# EAGLE design RF2ComLong (EAGLE 7.5.0)
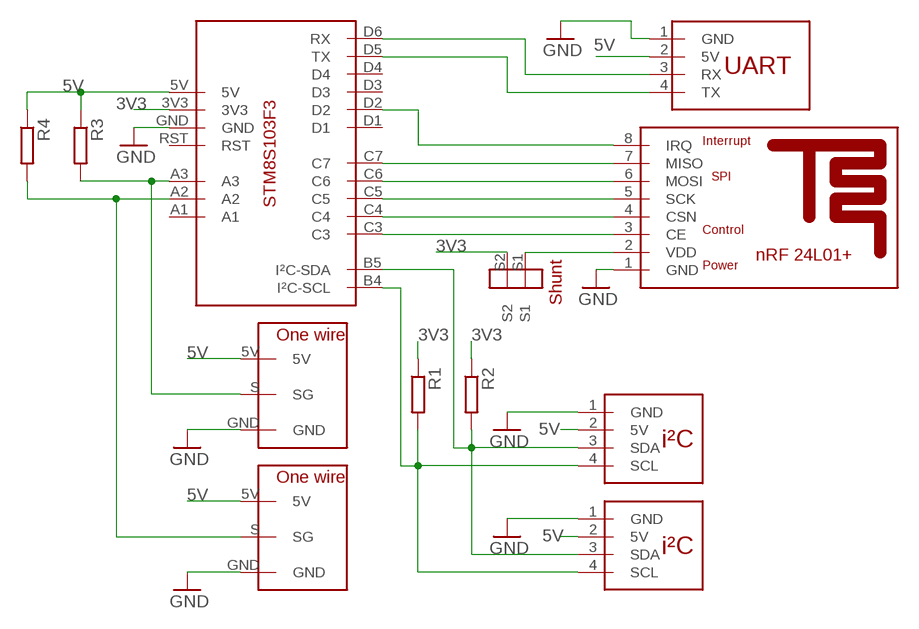
[diagram p0: schematic, sheet 1]

## Parts
R1  1k  R-EU_R1206  [R1206]
R2  1k  R-EU_R1206  [R1206]
R3  1k  R-EU_R1206  [R1206]
R4  1k  R-EU_R1206  [R1206]
U$1  STM8S103F3-DEVKITMINI  [STM8S103F3-DEVKIT-MINI]
U$2  NRF24L01+REFDESIGNMINI  [NRF24L01+REFDESIGN-MINI]
U$3  UARTMINI  [UART-MINI]
U$4  I2CMINI  [I2C-MINI]
U$5  ONE_WIRE  [ONE_WIRE]
U$6  ONE_WIRE  [ONE_WIRE]
U$7  I2CMINI  [I2C-MINI]
U$8  SMD_SHUNT  [SMD_SHUNT]

## Nets
3V3: R1.1 R2.1 U$1.3V3 U$8.S2
5V: R3.1 R4.1 U$1.5V U$3.2(5V) U$4.2(5V) U$5.5V U$6.5V U$7.2(5V)
GND: U$1.GND U$2.1(GND) U$3.1(GND) U$4.1(GND) U$5.GND U$6.GND U$7.1(GND)
N$1: U$1.D5(TX) U$3.4(TX)
N$2: U$1.C3 U$2.3(CE)
N$3: U$1.C4 U$2.4(CSN)
N$4: U$1.C5 U$2.5(SCK)
N$5: U$1.C6 U$2.6(MOSI)
N$6: U$1.C7 U$2.7(MISO)
N$7: R2.2 U$1.B5(I²C-SDA) U$4.3(SDA) U$7.3(SDA)
N$8: U$1.D2 U$2.8(IRQ)
N$9: U$1.D6(RX) U$3.3(RX)
N$10: R3.2 U$1.A3 U$6.S(SG)
N$12: R4.2 U$1.A2 U$5.S(SG)
N$13: R1.2 U$1.B4(I²C-SCL) U$4.4(SCL) U$7.4(SCL)
N$14: U$2.2(VDD) U$8.S1
Unconnected: U$1.A1 U$1.D1 U$1.D3 U$1.D4 U$1.RST

## Library data of the parts
R1-R4 = resistor:R-EU_: RESISTOR, European symbol
U$1 = STM8DevKit:STM8S103F3-DEVKIT: Development kit of the STM8S103F3 with a Test Led, power Led and reset button
U$2 = nRF24L01+RefDesign:NRF24L01+REFDESIGN
U$3 = WFConnectors:UART
U$4 U$7 = WFConnectors:I2C
U$5 U$6 = one-wire:ONE_WIRE
U$8 = wf-comp:SMD_SHUNT

## Net classes
0 default: width 0.305 mm, drill 0.508 mm, clearance 0.254 mm

## Board
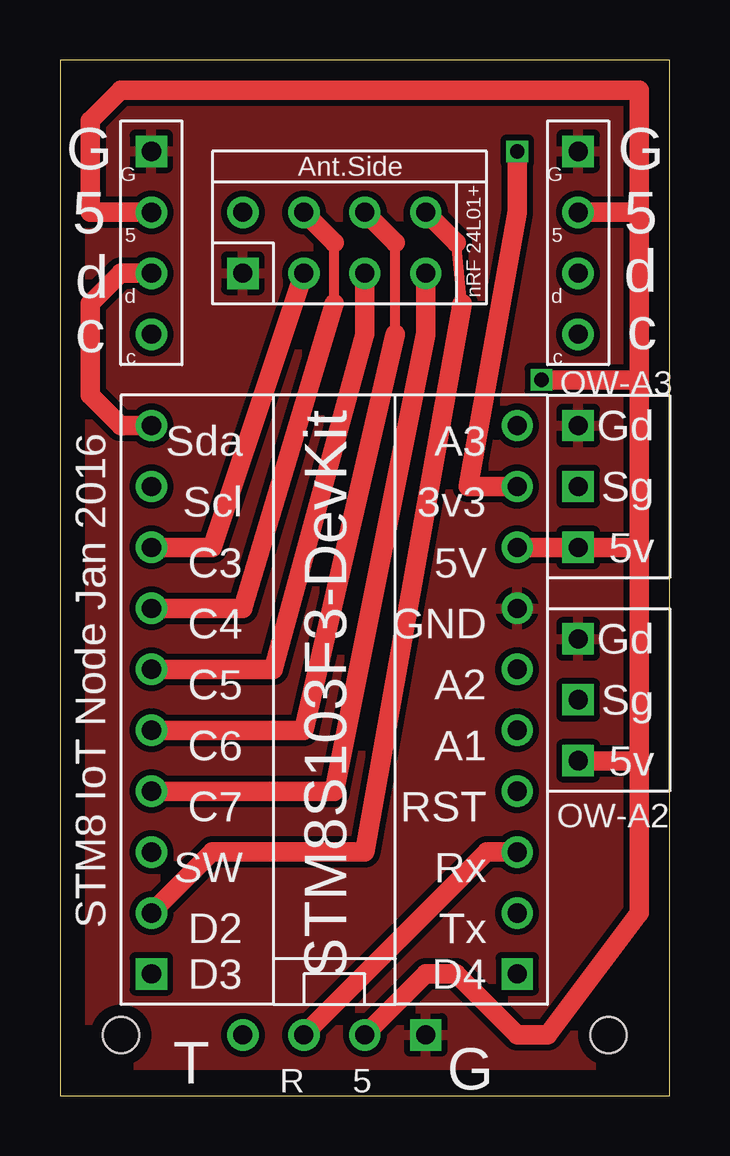
[diagram p1: board, top side]
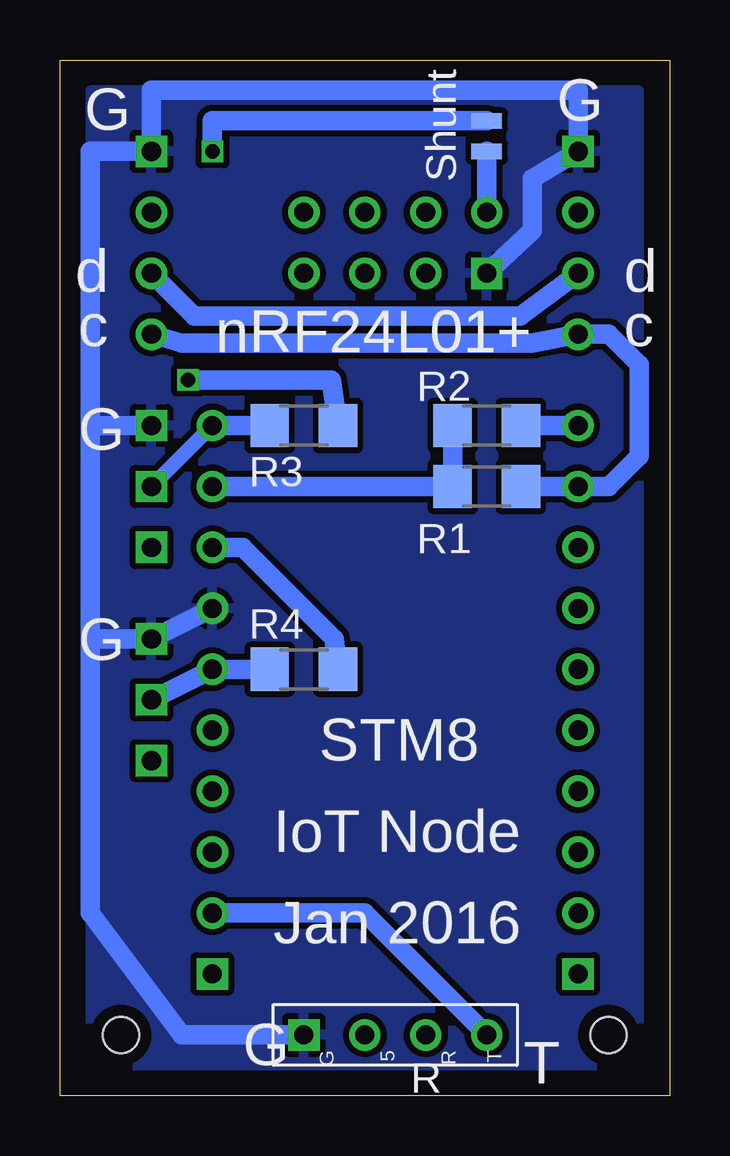
[diagram p2: board, bottom side, seen from below]

Size 25.4 x 43.18 mm. Coordinates in mm from the lower left corner, seen from the top.
Outline: 0,0 25.4,0 25.4,43.18 0,43.17 0,0
Copper layers (1*16): Top 0.035mm / dielectric 1.5mm / Bottom 0.035mm
Design rules "SmartPrototypingEagleRules": minimum track width 7mil, minimum drill 12mil, track to track 7mil, track to pad 7mil, pad to pad 7mil, via to via 7mil, smd to smd 0mil, copper to edge 20mil, drill to drill 10mil, minimum pad ring 10mil, minimum via ring 6mil, stop-mask expansion 2mil, vias tented up to drill 25mil, thermal gap 10mil
Holes 1.5 mm at 22.86,2.54 2.54,2.54

### Footprints (pad centres in the part's own frame; a part is rotated, then mirrored left to right if it is on the bottom)
R1206 = smd 1.6 x 1.803: 1 -1.422,0; 2 1.422,0
STM8S103F3-DEVKIT-MINI = drill 0.8: 3V3 -7.62,-7.62; 5V -7.62,-5.08; A1 -7.62,2.54; A2 -7.62,0; A3 -7.62,-10.16; B4 7.62,-7.62; B5 7.62,-10.16; C3 7.62,-5.08; C4 7.62,-2.54; C5 7.62,0; C6 7.62,2.54; C7 7.62,5.08; D1 7.62,7.62; D2 7.62,10.16; D5 -7.62,10.16; D6 -7.62,7.62; GND -7.62,-2.54; RST -7.62,5.08 | drill 0.8 square: D3 7.62,12.7; D4 -7.62,12.7
NRF24L01+REFDESIGN-MINI = drill 0.8 square: 1 -1.27,3.81 | drill 0.8: 2 1.27,3.81; 3 -1.27,1.27; 4 1.27,1.27; 5 -1.27,-1.27; 6 1.27,-1.27; 7 -1.27,-3.81; 8 1.27,-3.81
UART-MINI = drill 0.8 square: 1 0,0 | drill 0.8: 2 0,2.54; 3 0,5.08; 4 0,7.62
I2C-MINI = drill 0.8 square: 1 0,0 | drill 0.8: 2 0,2.54; 3 0,5.08; 4 0,7.62
ONE_WIRE = drill 0.8 square: 5V 0,2.54; GND 0,-2.54; S 0,0
SMD_SHUNT = smd 1.27 x 0.635: S1 0,0; S2 0,1.27

### Placement (x,y rotation side)
R1  7.62,25.4 0 bottom
R2  7.62,27.94 0 bottom
R3  15.24,27.94 180 bottom
R4  15.24,17.78 180 bottom
U$1  11.43,17.78 180 top
U$2  11.43,35.56 90 top
U$3  15.24,2.54 270 bottom
U$4  3.81,39.37 180 top
U$5  21.59,16.51 180 top
U$6  21.59,25.4 180 top
U$7  21.59,39.37 180 top
U$8  7.62,39.37 0 bottom

### Tracks (layer width: path | path; a pad name or v marks a point on that pad's centre or on a via)
3V3  (via drill 0.6)
  Top 0.813: U$1.3V3 17.02,25.4 19.05,36.83 v19.05,39.37
  Bottom 0.813: v19.05,39.37 19.05,40.64 U$8.S2 | R2.1 R1.1 U$1.3V3
5V  (via drill 0.6)
  Top 0.813: U$3.2 15.24,5.08 16.51,5.08 19.05,2.54 20.32,2.54 24.13,7.62 24.13,13.97 | U$5.5V 24.13,13.97 | 24.13,13.97 24.13,22.86 | 24.13,22.86 U$6.5V U$1.5V | 24.13,22.86 24.13,29.84 | 24.13,29.84 24.13,36.83 | 24.13,36.83 24.13,41.91 2.54,41.91 1.27,40.64 1.27,36.83 U$4.2 | U$7.2 24.13,36.83 | v20.07,29.84 24.13,29.84
  Bottom 0.813: R3.1 14.1,29.84 v20.07,29.84 | R4.1 13.97,19.05 17.78,22.86 U$1.5V
GND
  Bottom 0.813: U$3.1 20.32,2.54 24.13,7.62 24.13,19.05 | U$1.GND U$5.GND 24.13,19.05 | 24.13,19.05 24.13,27.94 | U$6.GND 24.13,27.94 | 24.13,27.94 24.13,39.37 U$7.1 21.59,41.91 3.81,41.91 U$4.1 5.71,38.23 5.71,36.07 U$2.1
  pour Bottom: 1.27,41.91 24.13,41.91 24.13,1.27 1.27,1.27
  pour Top: 1.27,41.91 24.13,41.91 24.13,1.27 1.27,1.27
N$1
  Bottom 0.813: U$3.4 12.7,7.62 U$1.D5
N$2
  Top 0.813: U$1.C3 6.35,22.86 U$2.3
N$3
  Top 0.406: 11.43,33.02 11.43,35.56
  Top 0.813: U$1.C4 7.62,20.32 11.43,33.02 | 11.43,35.56 U$2.4
N$4
  Top 0.813: U$1.C5 8.89,17.78 12.7,31.75 U$2.5
N$5
  Top 0.406: 13.97,31.75 13.97,35.56
  Top 0.813: U$1.C6 10.16,15.24 13.97,31.75 | 13.97,35.56 U$2.6
N$6
  Top 0.813: U$1.C7 11.43,12.7 15.24,31.75 U$2.7
N$7
  Top 0.813: U$1.B5 2.54,27.94 1.27,29.21 1.27,33.02 2.54,34.29 U$4.3
  Bottom 0.813: U$4.3 6.22,32.51 19.81,32.51 U$7.3 | R2.2 U$1.B5
N$8
  Top 0.406: 16.76,33.02 16.51,35.56
  Top 0.813: 16.51,35.56 U$2.8 | 16.76,33.02 12.7,10.16 6.35,10.16 U$1.D2
N$9
  Top 0.813: U$3.3 17.78,10.16 U$1.D6
N$10
  Bottom 0.61: U$1.A3 U$6.S
  Bottom 0.813: R3.2 U$1.A3
N$12
  Bottom 0.813: 16.51,17.78 R4.2 U$1.A2 U$5.S
N$13
  Bottom 0.813: R1.2 U$1.B4 2.54,25.4 1.27,26.67 1.27,30.48 2.54,31.75 U$4.4 5.71,31.37 20.32,31.37 U$7.4
N$14
  Bottom 0.813: U$8.S1 U$2.2

### Text on the board
tPlace: G | G | 5 | 5 | d | d | c | c | OW-A3 | OW-A2 | STM8 IoT Node Jan 2016 | T | R | 5 | G
bPlace: G | G | d | d | c | nRF24L01+ | c | G | G | STM8 | IoT Node | Jan 2016 | T | G | R